# EAGLE schematic Wireless Buzzer (EAGLE 6.4)
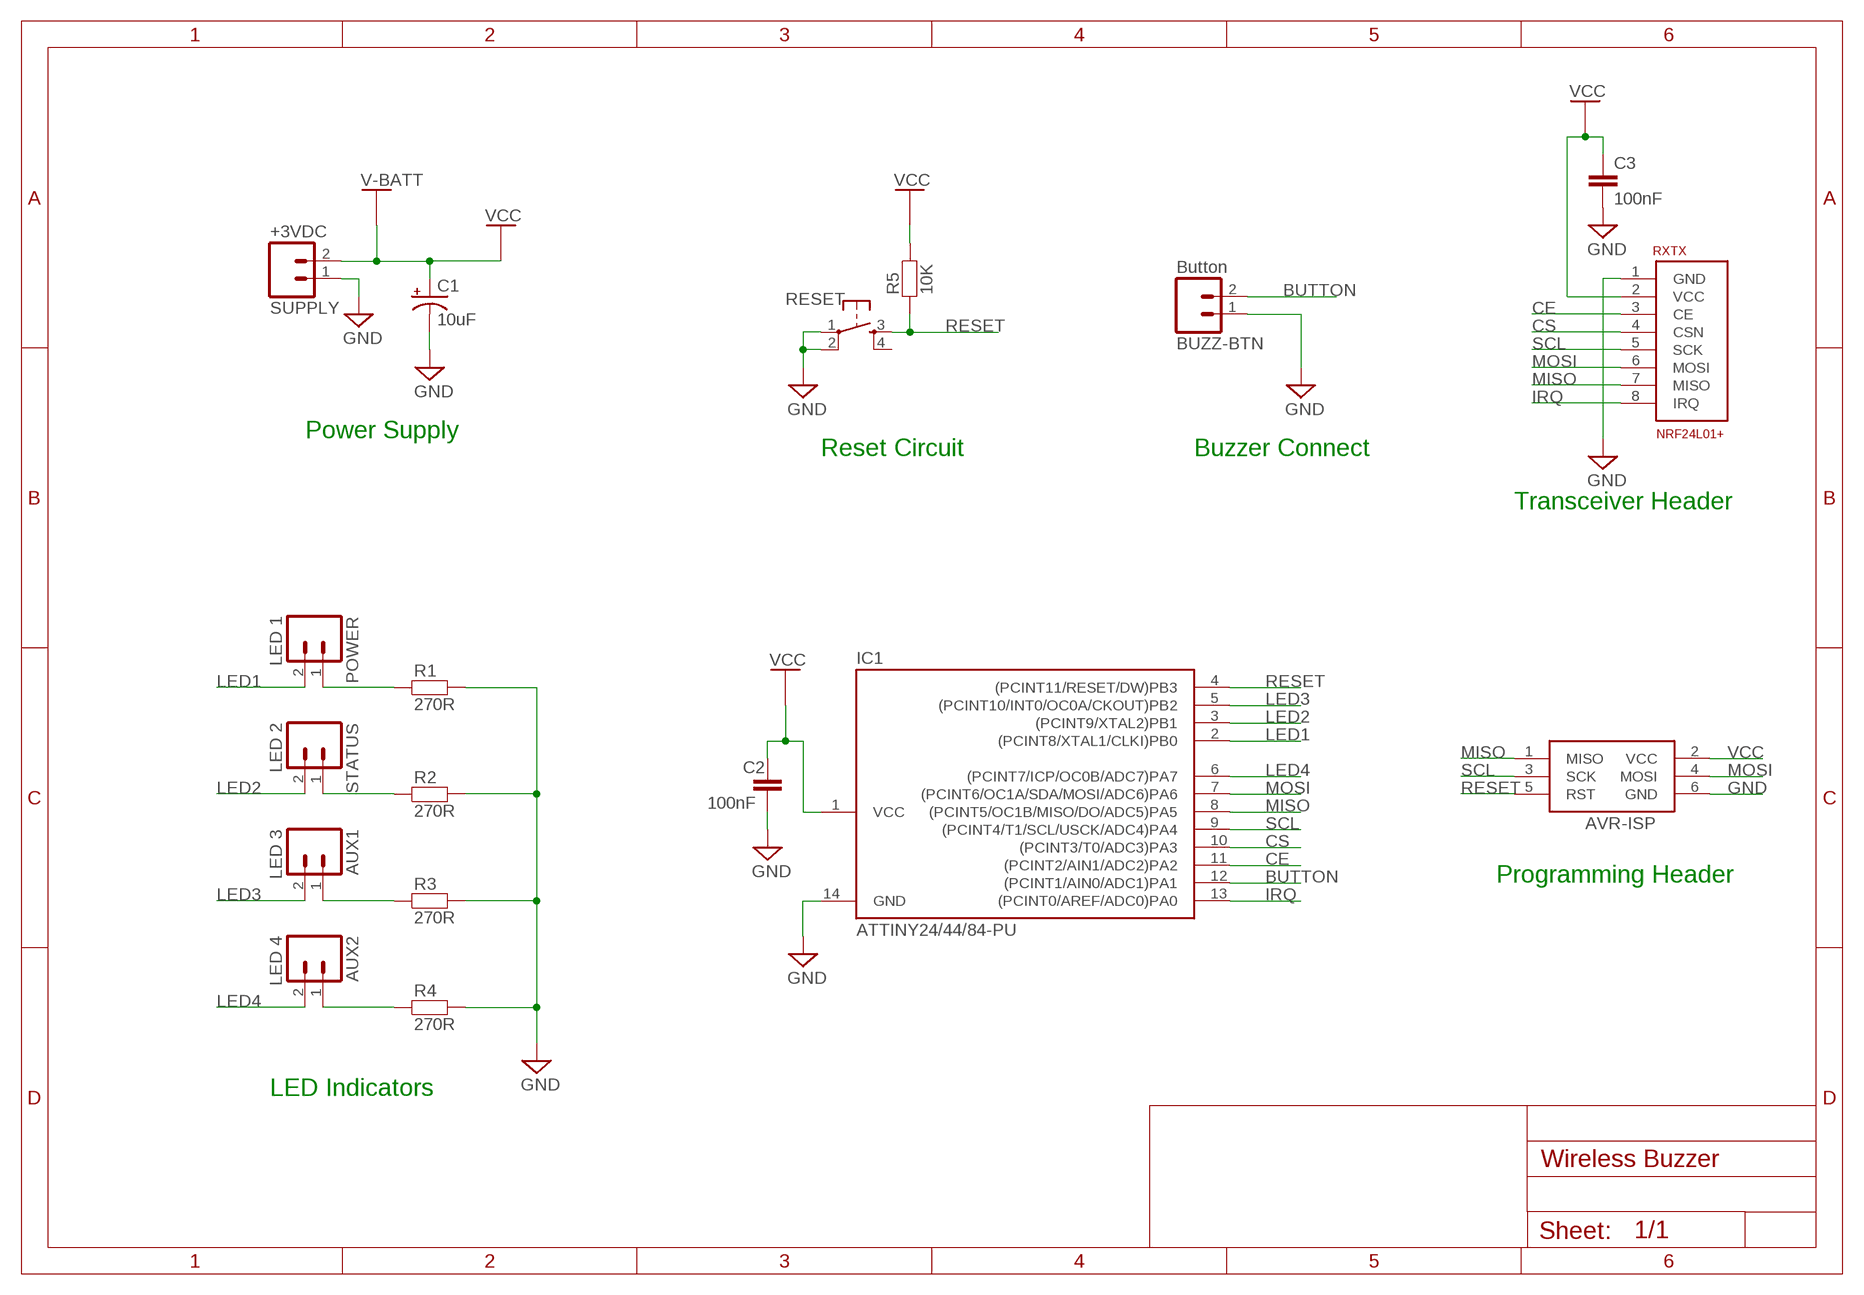
[diagram p0: schematic, sheet 1]

## Parts
AUX1  LED 3  KK-CONNECT-2WAY_PG  [KK-CONNECT-2WAY-PG]
AUX2  LED 4  KK-CONNECT-2WAY_PG  [KK-CONNECT-2WAY-PG]
AVR-ISP  AVRISP-6  [AVRISP]
BUZZ-BTN  Button  KK-CONNECT-2WAY_PG  [KK-CONNECT-2WAY-PG]
C1  10uF  CAP-POL-SM-TANT_D  [SM-TANT-D_EIA7343]
C2  100nF  CAPACITOR-SM-1206  [SM-1206_PG]
C3  100nF  CAPACITOR-SM-1206  [SM-1206_PG]
IC1  ATTINY24/44/84-PU  [DIL14]
POWER  LED 1  KK-CONNECT-2WAY_PG  [KK-CONNECT-2WAY-PG]
R1  270R  RESISTOR-SM-1206  [SM-1206_PG]
R2  270R  RESISTOR-SM-1206  [SM-1206_PG]
R3  270R  RESISTOR-SM-1206  [SM-1206_PG]
R4  270R  RESISTOR-SM-1206  [SM-1206_PG]
R5  10K  RESISTOR-SM-1206  [SM-1206_PG]
RESET  DTSM-6  [DTSM-6]
RXTX  NRF24L01+  [NRF24L01+-HEADER]
STATUS  LED 2  KK-CONNECT-2WAY_PG  [KK-CONNECT-2WAY-PG]
SUPPLY  +3VDC  KK-CONNECT-2WAY_PG  [KK-CONNECT-2WAY-PG]

## Nets
BUTTON: BUZZ-BTN.2 IC1.12((PCINT1/AIN0/ADC1)PA1)
CE: IC1.11((PCINT2/AIN1/ADC2)PA2) RXTX.3(CE)
CS: IC1.10((PCINT3/T0/ADC3)PA3) RXTX.4(CSN)
GND: AVR-ISP.6(GND) BUZZ-BTN.1 C1.C(-) C2.P$2 C3.P$2 IC1.14(GND) R1.P$2 R2.P$2 R3.P$2 R4.P$2 RESET.1 RESET.2 RXTX.1(GND) SUPPLY.1
IRQ: IC1.13((PCINT0/AREF/ADC0)PA0) RXTX.8(IRQ)
LED1: IC1.2((PCINT8/XTAL1/CLKI)PB0) POWER.2
LED2: IC1.3((PCINT9/XTAL2)PB1) STATUS.2
LED3: AUX1.2 IC1.5((PCINT10/INT0/OC0A/CKOUT)PB2)
LED4: AUX2.2 IC1.6((PCINT7/ICP/OC0B/ADC7)PA7)
MISO: AVR-ISP.1(MISO) IC1.8((PCINT5/OC1B/MISO/DO/ADC5)PA5) RXTX.7(MISO)
MOSI: AVR-ISP.4(MOSI) IC1.7((PCINT6/OC1A/SDA/MOSI/ADC6)PA6) RXTX.6(MOSI)
N$1: POWER.1 R1.P$1
N$3: R2.P$1 STATUS.1
N$5: AUX1.1 R3.P$1
N$7: AUX2.1 R4.P$1
RESET: AVR-ISP.5(RST) IC1.4((PCINT11/RESET/DW)PB3) R5.P$1 RESET.3
SCL: AVR-ISP.3(SCK) IC1.9((PCINT4/T1/SCL/USCK/ADC4)PA4) RXTX.5(SCK)
VCC: AVR-ISP.2(VCC) C1.A(+) C2.P$1 C3.P$1 IC1.1(VCC) R5.P$2 RXTX.2(VCC) SUPPLY.2 ; supply symbol labelled V-BATT
Unconnected: RESET.4

## Notes on the sheet
- Power Supply
- Reset Circuit | Buzzer Connect
- Transceiver Header
- Programming Header
- LED Indicators

## Library data of the parts
AUX1 AUX2 BUZZ-BTN POWER STATUS SUPPLY = Peter G 060611:KK-CONNECT-2WAY_PG: KK Connector 2 way; 0.1". E14: Header 973-1148; Housing 143-126
AVR-ISP = adafruit:AVRISP: AVR ISP HEADER Standard 6 pin header for AVR programming
C1 = Peter G 060611:CAP-POL: Polarised capacitors. Tantalum, Electrolytic
C2 C3 = Peter G 060611:CAPACITOR: Capacitor
IC1 = attiny24_44_84:ATTINY24/44/84
R1-R5 = Peter G 060611:RESISTOR
RESET = switch-tact:DTSM-6
RXTX = Leenix:NRF24L01+